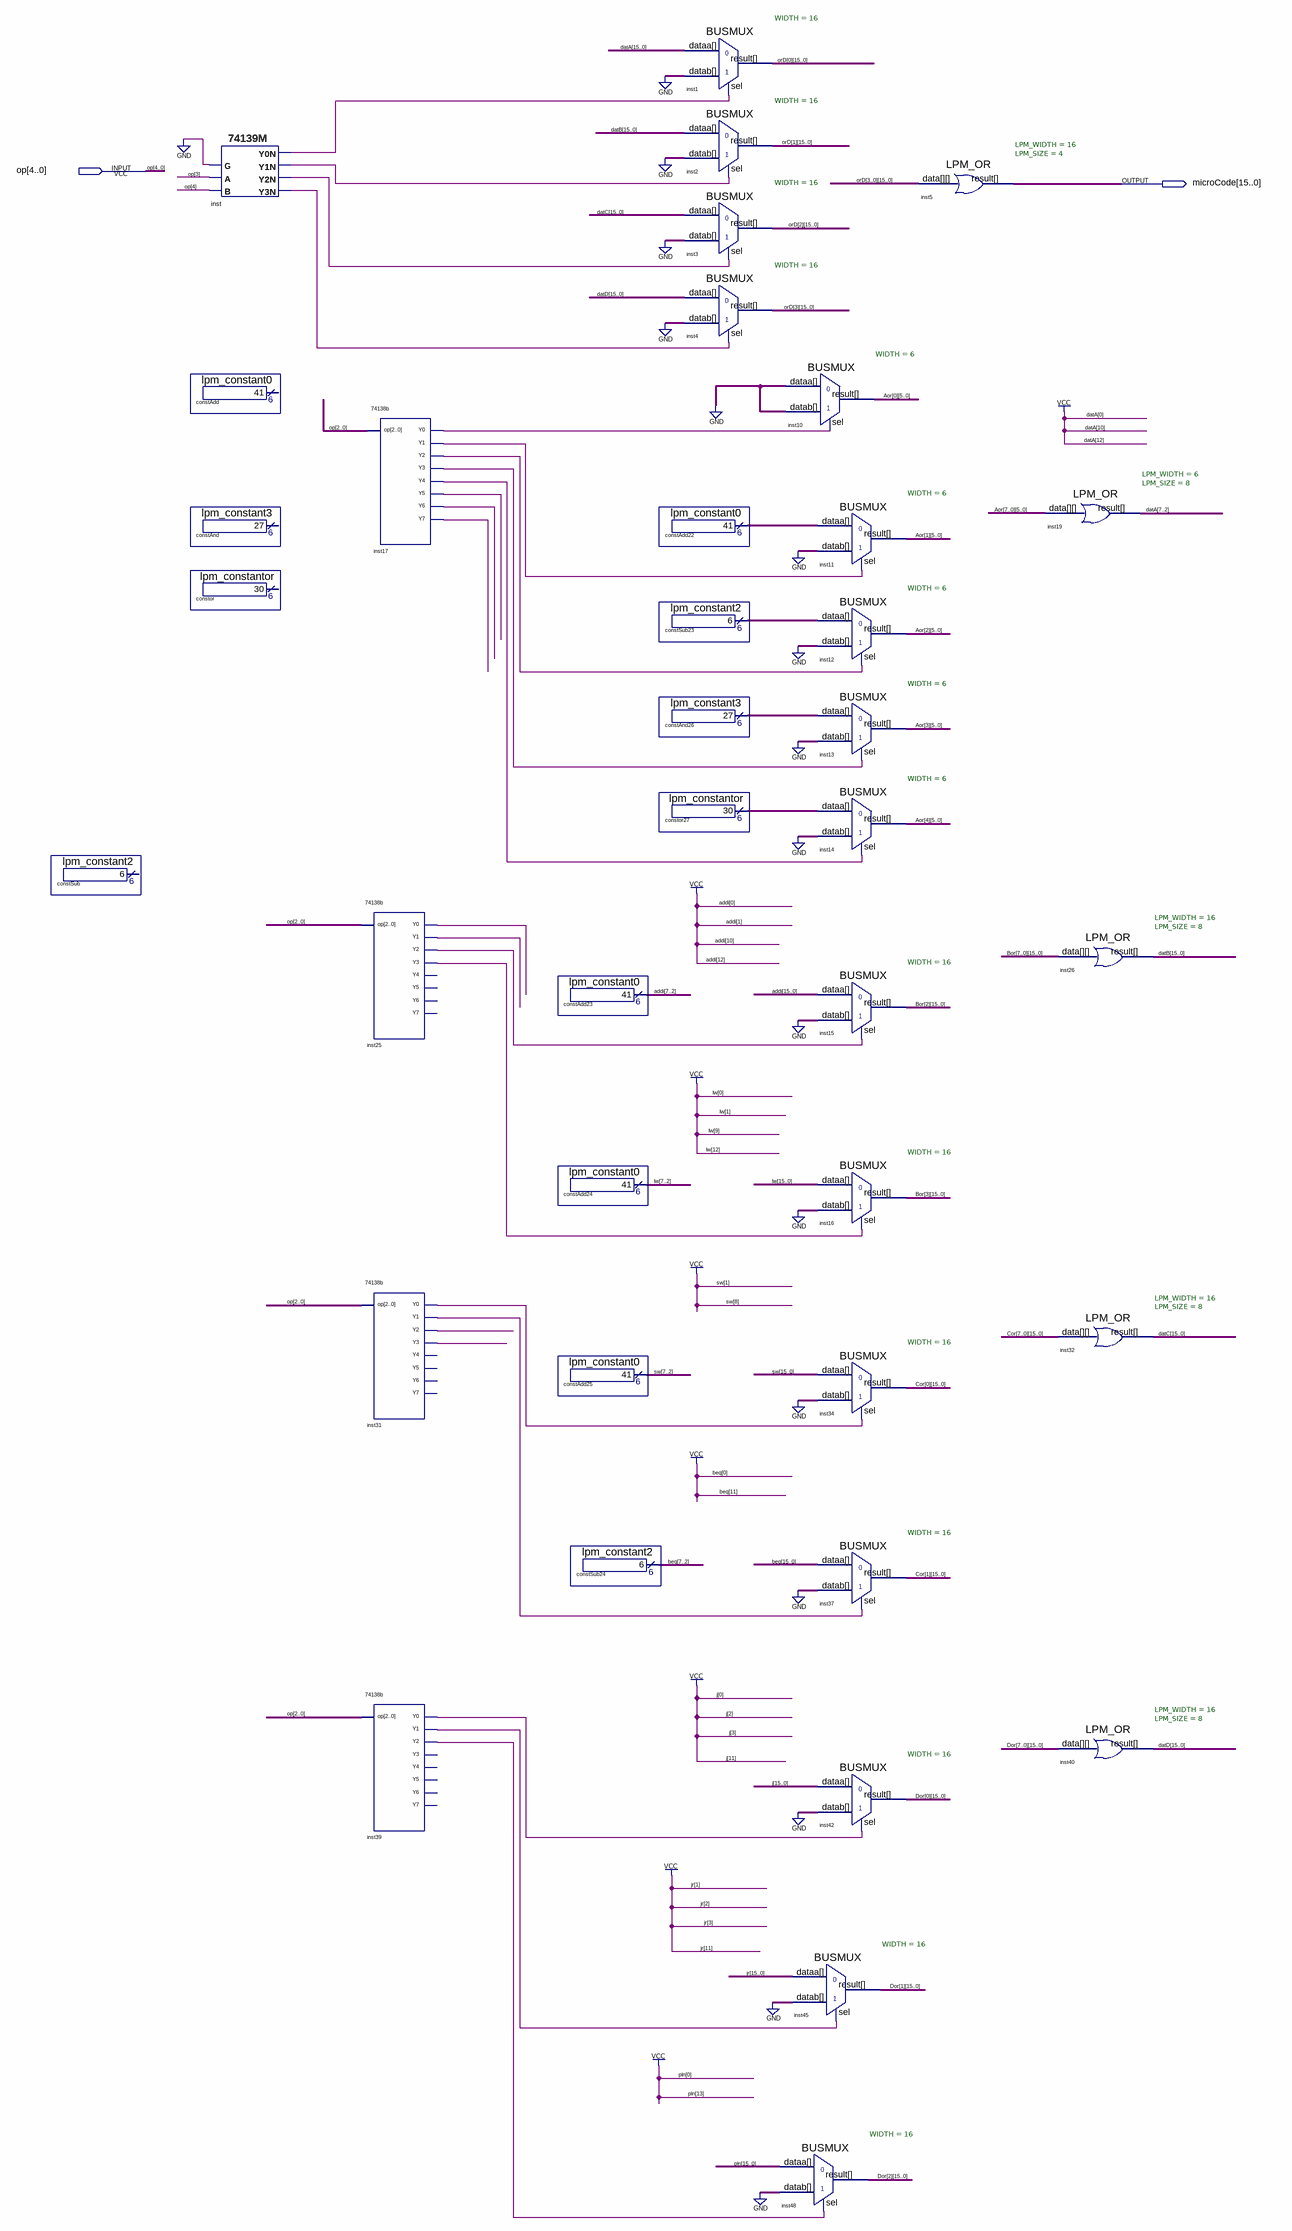
[diagram p0: schematic sheet]
// Quartus schematic hardCode.bdf as structural Verilog: 38 symbols, 2 pins
module hardCode (
  input  [4:0] op,
  output [15:0] microCode
);

  wire inst17_y0, inst17_y1, inst17_y2, inst17_y3, inst17_y4, inst17_y5, inst17_y6, inst17_y7, inst25_y0,
       inst25_y1, inst25_y2, inst25_y3, inst31_y0, inst31_y1, inst31_y2, inst31_y3, inst39_y0, inst39_y1,
       inst39_y2, inst_y0n, inst_y1n, inst_y2n, inst_y3n;
  wire [5:0] Aor_0, Aor_1, Aor_2, Aor_3, Aor_4, Aor_5, Aor_6, Aor_7, constAdd22_result, constAnd26_result,
       constor27_result, constSub23_result;
  wire [15:0] Bor_0, Bor_1, Bor_2, Bor_3, Bor_4, Bor_5, Bor_6, Bor_7, Cor_0, Cor_1, Cor_2, Cor_3, Cor_4,
       Cor_5, Cor_6, Cor_7, datB, datC, datD, Dor_0, Dor_1, Dor_2, Dor_3, Dor_4, Dor_5, Dor_6, Dor_7, jr,
       orD_0, orD_1, orD_2, orD_3, sw;
  wire [15:1] beq, datA, j, pln;
  wire [15:2] addi, lw;

  lpm_constant2 constSub ();  // open: result
  \74139M  inst (.B(op[4]), .A(op[3]), .G(1'b0), .Y3N(inst_y3n), .Y2N(inst_y2n), .Y0N(inst_y0n), .Y1N(inst_y1n));
  lpm_constant0 constAdd ();  // open: result
  lpm_constant3 constAnd ();  // open: result
  lpm_constantor constor ();  // open: result
  \74138b  inst17 (
    .op(op[2:0]), .Y0(inst17_y0), .Y1(inst17_y1), .Y2(inst17_y2), .Y3(inst17_y3), .Y4(inst17_y4),
    .Y5(inst17_y5), .Y6(inst17_y6), .Y7(inst17_y7));
  \74138b  inst25 (
    .op(op[2:0]), .Y0(inst25_y0), .Y1(inst25_y1), .Y2(inst25_y2), .Y3(inst25_y3));  // open: Y4, Y5, Y6, Y7
  \74138b  inst31 (
    .op(op[2:0]), .Y0(inst31_y0), .Y1(inst31_y1), .Y2(inst31_y2), .Y3(inst31_y3));  // open: Y4, Y5, Y6, Y7
  \74138b  inst39 (.op(op[2:0]), .Y0(inst39_y0), .Y1(inst39_y1), .Y2(inst39_y2));  // open: Y3, Y4, Y5, Y6, Y7
  lpm_constant0 constAdd23 (.result(addi[7:2]));
  lpm_constant0 constAdd24 (.result(lw[7:2]));
  lpm_constant0 constAdd25 (.result(sw[7:2]));
  lpm_constant2 constSub24 (.result(beq[7:2]));
  BUSMUX #(.WIDTH(16)) inst1 (
    .datab({16{1'b0}}), .sel(inst_y0n), .dataa({datA[15:13], 1'b1, datA[11], 1'b1, datA[9:1], 1'b1}),
    .result(orD_0));
  BUSMUX #(.WIDTH(16)) inst2 (.datab({16{1'b0}}), .sel(inst_y1n), .dataa(datB), .result(orD_1));
  BUSMUX #(.WIDTH(16)) inst3 (.datab({16{1'b0}}), .sel(inst_y2n), .dataa(datC), .result(orD_2));
  BUSMUX #(.WIDTH(16)) inst4 (.datab({16{1'b0}}), .sel(inst_y3n), .dataa(datD), .result(orD_3));
  lpm_constant0 constAdd22 (.result(constAdd22_result));
  lpm_constant2 constSub23 (.result(constSub23_result));
  lpm_constant3 constAnd26 (.result(constAnd26_result));
  lpm_constantor constor27 (.result(constor27_result));
  BUSMUX #(.WIDTH(6)) inst10 (.datab({6{1'b0}}), .sel(inst17_y0), .dataa({6{1'b0}}), .result(Aor_0));
  BUSMUX #(.WIDTH(16)) inst48 (
    .datab({16{1'b0}}), .sel(inst39_y2), .dataa({pln[15:14], 1'b1, pln[12:1], 1'b1}), .result(Dor_2));
  BUSMUX #(.WIDTH(6)) inst11 (.datab({6{1'b0}}), .sel(inst17_y1), .dataa(constAdd22_result), .result(Aor_1));
  BUSMUX #(.WIDTH(6)) inst12 (.datab({6{1'b0}}), .sel(inst17_y2), .dataa(constSub23_result), .result(Aor_2));
  BUSMUX #(.WIDTH(6)) inst13 (.datab({6{1'b0}}), .sel(inst17_y3), .dataa(constAnd26_result), .result(Aor_3));
  BUSMUX #(.WIDTH(6)) inst14 (.datab({6{1'b0}}), .sel(inst17_y4), .dataa(constor27_result), .result(Aor_4));
  BUSMUX #(.WIDTH(16)) inst15 (
    .datab({16{1'b0}}), .sel(inst25_y2), .dataa({addi[15:13], 1'b1, addi[11], 1'b1, addi[9:2], 2'b11}),
    .result(Bor_2));
  BUSMUX #(.WIDTH(16)) inst16 (
    .datab({16{1'b0}}), .sel(inst25_y3), .dataa({lw[15:13], 1'b1, lw[11:10], 1'b1, lw[8:2], 2'b11}),
    .result(Bor_3));
  BUSMUX #(.WIDTH(16)) inst34 (
    .datab({16{1'b0}}), .sel(inst31_y0), .dataa({sw[15:9], 1'b1, sw[7:2], 1'b1, sw[0]}), .result(Cor_0));
  BUSMUX #(.WIDTH(16)) inst37 (
    .datab({16{1'b0}}), .sel(inst31_y1), .dataa({beq[15:12], 1'b1, beq[10:1], 1'b1}), .result(Cor_1));
  BUSMUX #(.WIDTH(16)) inst42 (
    .datab({16{1'b0}}), .sel(inst39_y0), .dataa({j[15:12], 1'b1, j[10:4], 2'b11, j[1], 1'b1}), .result(Dor_0));
  BUSMUX #(.WIDTH(16)) inst45 (
    .datab({16{1'b0}}), .sel(inst39_y1), .dataa({jr[15:12], 1'b1, jr[10:4], 3'b111, jr[0]}), .result(Dor_1));
  LPM_OR #(.LPM_WIDTH(16), .LPM_SIZE(4)) inst5 (.data({orD_3, orD_2, orD_1, orD_0}), .result(microCode));
  LPM_OR #(.LPM_WIDTH(6), .LPM_SIZE(8)) inst19 (
    .data({Aor_7, Aor_6, Aor_5, Aor_4, Aor_3, Aor_2, Aor_1, Aor_0}), .result(datA[7:2]));
  LPM_OR #(.LPM_WIDTH(16), .LPM_SIZE(8)) inst26 (
    .data({Bor_7, Bor_6, Bor_5, Bor_4, Bor_3, Bor_2, Bor_1, Bor_0}), .result(datB));
  LPM_OR #(.LPM_WIDTH(16), .LPM_SIZE(8)) inst32 (
    .data({Cor_7, Cor_6, Cor_5, Cor_4, Cor_3, Cor_2, Cor_1, Cor_0}), .result(datC));
  LPM_OR #(.LPM_WIDTH(16), .LPM_SIZE(8)) inst40 (
    .data({Dor_7, Dor_6, Dor_5, Dor_4, Dor_3, Dor_2, Dor_1, Dor_0}), .result(datD));
endmodule
